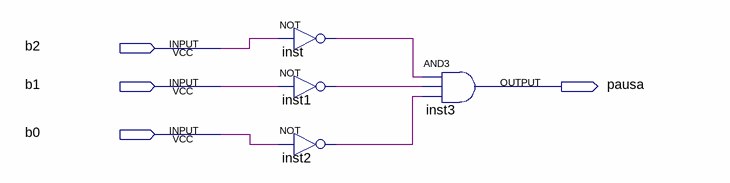
[diagram p0: schematic sheet]
// Quartus schematic detectorPausa.bdf as structural Verilog: 4 symbols, 4 pins
module detectorPausa (
  input  b2,
  input  b1,
  input  b0,
  output pausa
);

  wire inst1_out, inst2_out, inst_out;

  not inst (inst_out, b2);
  not inst1 (inst1_out, b1);
  not inst2 (inst2_out, b0);
  and inst3 (pausa, inst_out, inst1_out, inst2_out);
endmodule
